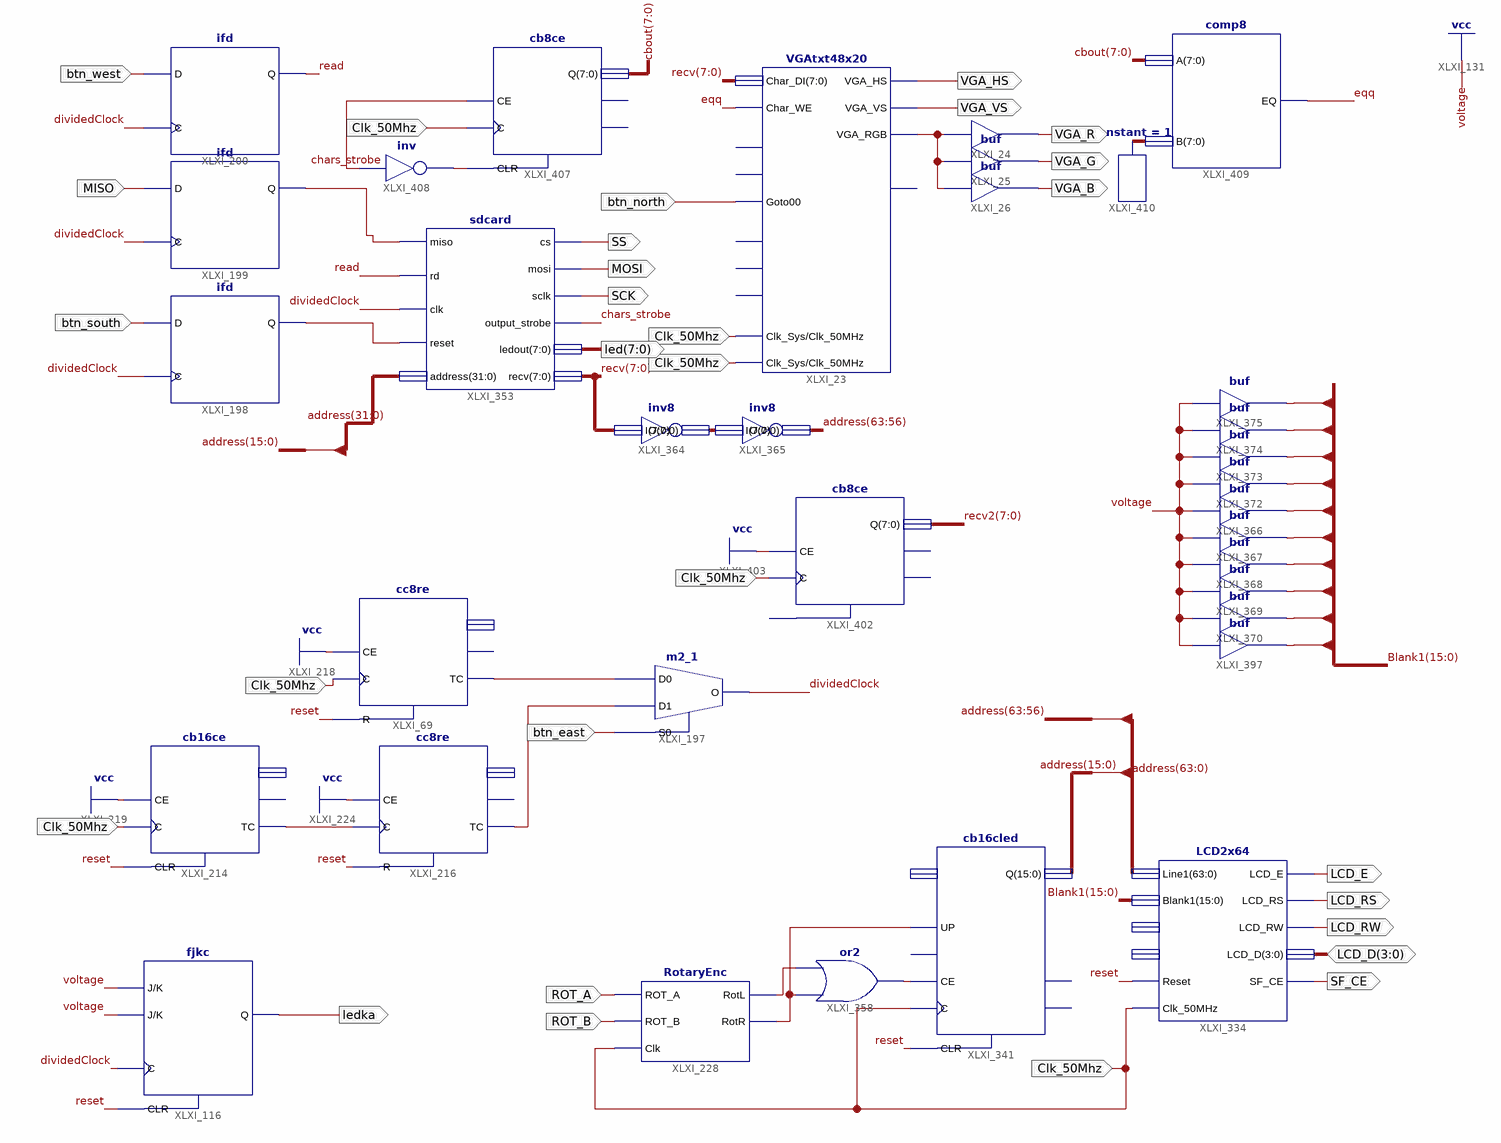
[diagram p0: schematic sheet 1]
// Xilinx ISE schematic schemat.sch (spartan3e) as structural Verilog: 34 symbols, 23 ports
module schemat (
  input  btn_south,
  input  MISO,
  input  btn_west,
  input  btn_east,
  input  ROT_A,
  input  ROT_B,
  input  btn_north,
  input  Clk_50Mhz,
  inout  [3:0] LCD_D,
  output ledka,
  output LCD_E,
  output LCD_RS,
  output LCD_RW,
  output SF_CE,
  output VGA_VS,
  output [7:0] led,
  output VGA_HS,
  output VGA_R,
  output VGA_G,
  output VGA_B,
  output SCK,
  output MOSI,
  output SS
);

  wire chars_strobe, dividedClock, eqq, read, reset, XLXN_88, XLXN_191, XLXN_248, XLXN_305, XLXN_953,
       XLXN_955, XLXN_973, XLXN_975, XLXN_984, XLXN_1060;
  wire [7:0] cbout, recv, recv2, XLXN_983, XLXN_1063;
  wire [15:0] Blank1;
  wire [63:0] address;

  ifd XLXI_199 (.C(dividedClock), .D(MISO), .Q(XLXN_953));
  ifd XLXI_200 (.C(dividedClock), .D(btn_west), .Q(read));
  ifd XLXI_198 (.C(dividedClock), .D(btn_south), .Q(XLXN_955));
  cc8re XLXI_69 (.C(Clk_50Mhz), .CE(1'b1), .R(reset), .TC(XLXN_248));  // open: CEO, Q
  m2_1 XLXI_197 (.D0(XLXN_248), .D1(XLXN_305), .S0(btn_east), .O(dividedClock));
  cc8re XLXI_216 (.C(XLXN_191), .CE(1'b1), .R(reset), .TC(XLXN_305));  // open: CEO, Q
  cb16ce XLXI_214 (.C(Clk_50Mhz), .CE(1'b1), .CLR(reset), .TC(XLXN_191));  // open: CEO, Q
  fjkc XLXI_116 (.C(dividedClock), .CLR(reset), .J(1'b1), .K(1'b1), .Q(ledka));
  cb16cled XLXI_341 (
    .C(Clk_50Mhz), .CE(XLXN_973), .CLR(reset), .UP(XLXN_975), .Q(address[15:0]));  // open: D, L, CEO, TC
  LCD2x64 XLXI_334 (
    .Line1(address), .Blank1(Blank1), .LCD_D(LCD_D), .LCD_E(LCD_E), .LCD_RW(LCD_RW), .LCD_RS(LCD_RS),
    .SF_CE(SF_CE), .Reset(reset), .Clk_50MHz(Clk_50Mhz));  // open: Line2, Blank2
  RotaryEnc XLXI_228 (.ROT_A(ROT_A), .ROT_B(ROT_B), .RotL(XLXN_984), .RotR(XLXN_975), .Clk(Clk_50Mhz));
  sdcard XLXI_353 (
    .miso(XLXN_953), .rd(read), .clk(dividedClock), .reset(XLXN_955), .address(address[31:0]), .cs(SS),
    .mosi(MOSI), .sclk(SCK), .output_strobe(chars_strobe), .ledout(led), .recv(recv));
  buf XLXI_24 (VGA_R, XLXN_88);
  buf XLXI_25 (VGA_G, XLXN_88);
  buf XLXI_26 (VGA_B, XLXN_88);
  or XLXI_358 (XLXN_973, XLXN_975, XLXN_984);
  inv8 XLXI_364 (.I(recv), .O(XLXN_983));
  inv8 XLXI_365 (.I(XLXN_983), .O(address[63:56]));
  buf XLXI_375 (Blank1[13], 1'b1);
  buf XLXI_374 (Blank1[12], 1'b1);
  buf XLXI_373 (Blank1[11], 1'b1);
  buf XLXI_372 (Blank1[10], 1'b1);
  buf XLXI_370 (Blank1[5], 1'b1);
  buf XLXI_369 (Blank1[6], 1'b1);
  buf XLXI_368 (Blank1[7], 1'b1);
  buf XLXI_367 (Blank1[8], 1'b1);
  buf XLXI_366 (Blank1[9], 1'b1);
  buf XLXI_397 (Blank1[4], 1'b1);
  cb8ce XLXI_402 (.C(Clk_50Mhz), .CE(1'b1), .Q(recv2));  // open: CLR, CEO, TC
  VGAtxt48x20 XLXI_23 (
    .Char_DI(recv), .Goto00(btn_north), .Clk_Sys(Clk_50Mhz), .Clk_50MHz(Clk_50Mhz), .VGA_HS(VGA_HS),
    .VGA_VS(VGA_VS), .VGA_RGB(XLXN_88), .Char_WE(eqq));  // open: Home, NewLine, CursorOn, ScrollEn, ScrollClear, Busy
  cb8ce XLXI_407 (.C(Clk_50Mhz), .CE(chars_strobe), .CLR(XLXN_1060), .Q(cbout));  // open: CEO, TC
  not XLXI_408 (XLXN_1060, chars_strobe);
  comp8 XLXI_409 (.A(cbout), .B(XLXN_1063), .EQ(eqq));
  constant #(.CValue("1")) XLXI_410 (.O(XLXN_1063));
endmodule
